# EAGLE design mcdm.v52 (EAGLE 7.3.0)

## Sheet 1 of 2
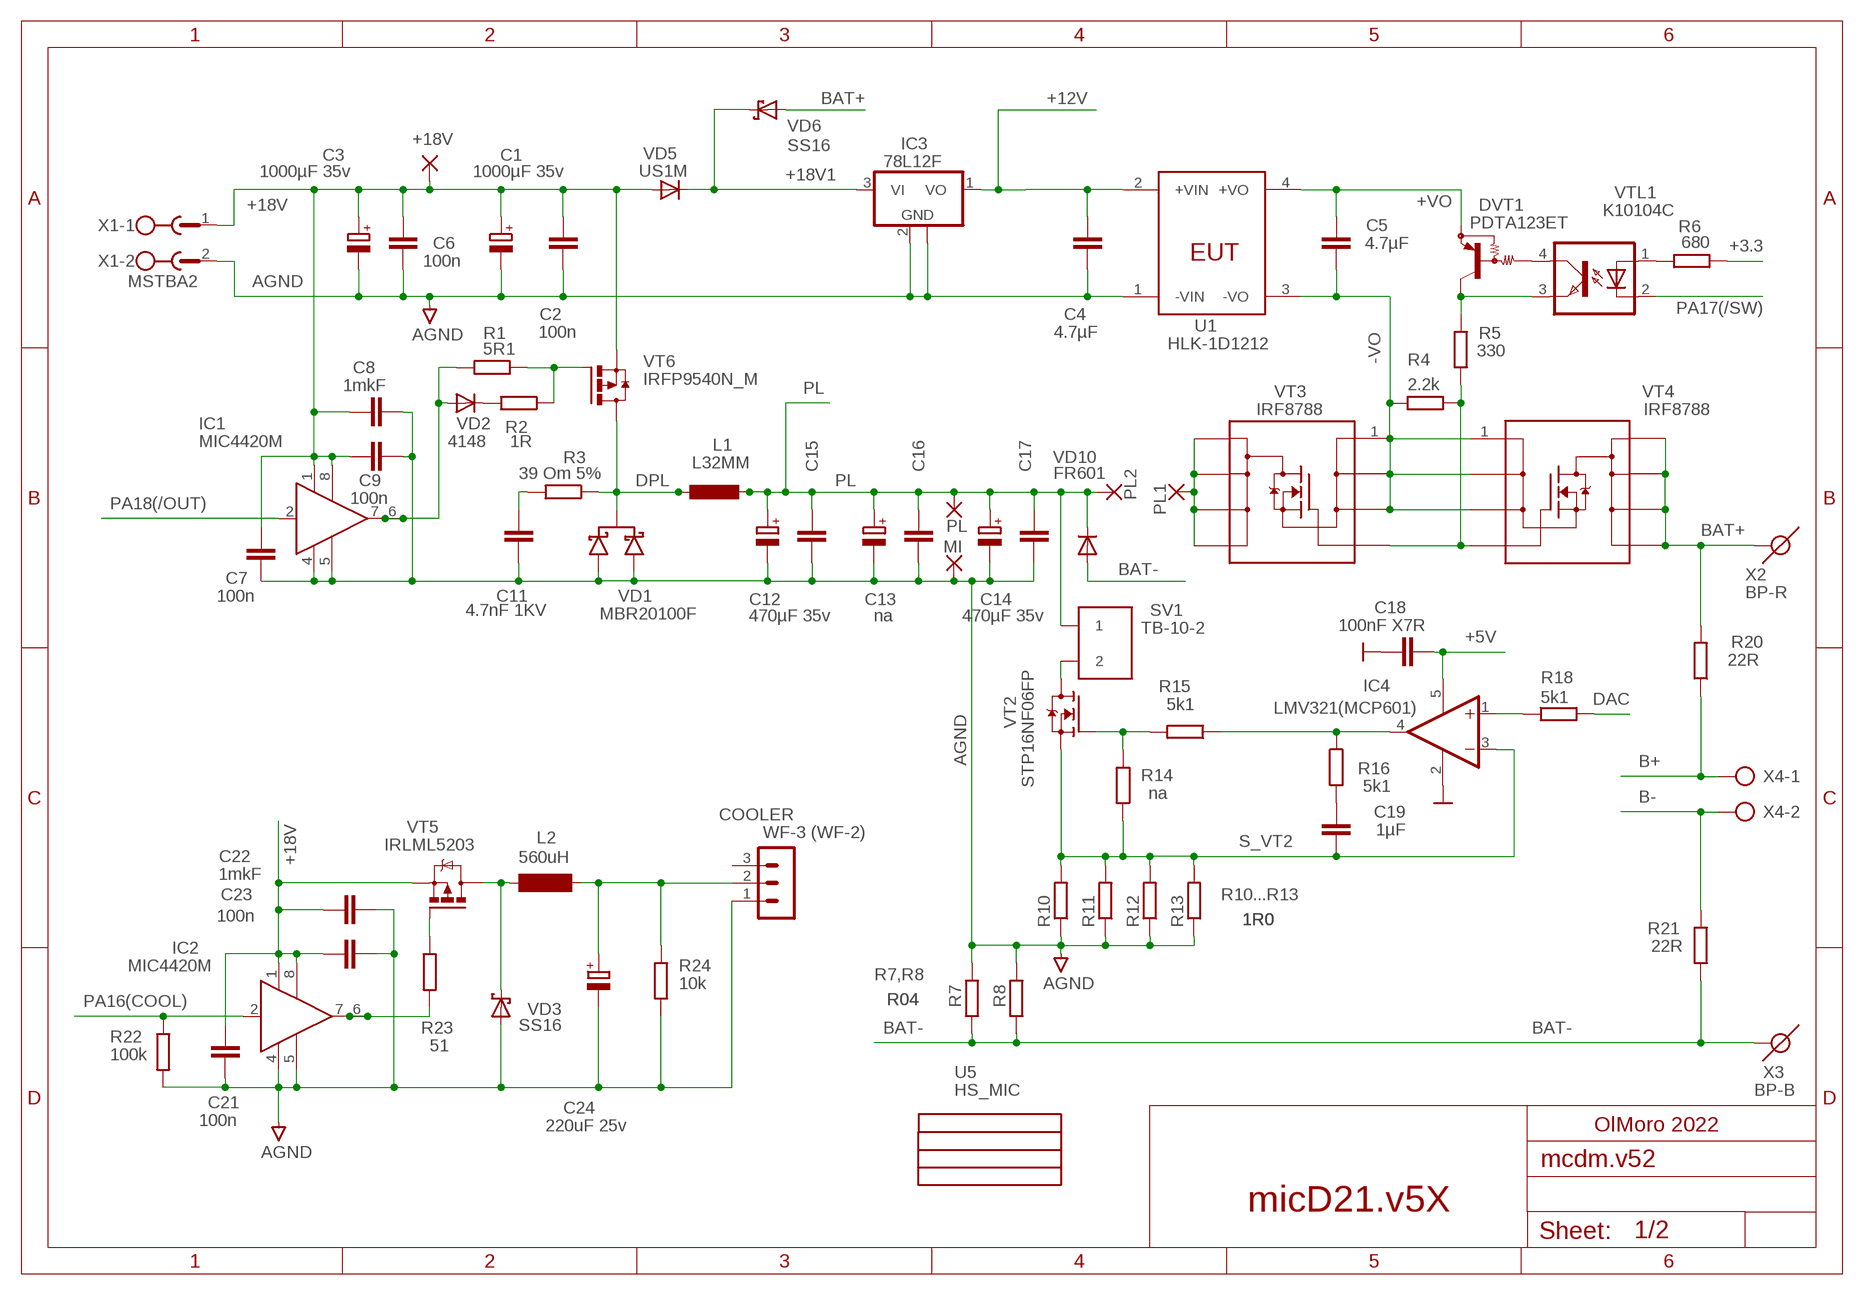
[diagram p0: schematic, sheet 1]

### Parts
+18V  WIREPAD1,6/0,8  [1,6/0,8]
C1  1000µF 35v  CPOL-EUE5-10.5  [E5-10,5]
C2  100n  C-EUC0805  [C0805]
C3  1000µF 35v  CPOL-EUE5-10.5  [E5-10,5]
C4  4.7µF  C-EUC0603  [C0603]
C5  4.7µF  C-EUC0603  [C0603]
C6  100n  C-EUC0805  [C0805]
C7  100n  C-EUC0603  [C0603]
C8  1mkF  C-EUC0603  [C0603]
C9  100n  C-EUC0603  [C0603]
C11  4.7nF 1KV  C-EU102-064X133  [C102-064X133]
C12  470µF 35v  CPOL-EUE5-10.5  [E5-10,5]
C13  na  CPOL-EUE5-10.5  [E5-10,5]
C14  470µF 35v  CPOL-EUE5-10.5  [E5-10,5]
C15  1mkF  C-EUC0805  [C0805]
C16  1mkF  C-EUC0805  [C0805]
C17  1mkF  C-EUC0805  [C0805]
C18  100nF X7R  C-EUC0603  [C0603]
C19  1µF  C-EUC0603  [C0603]
C21  100n  C-EUC0603  [C0603]
C22  1mkF  C-EUC0603  [C0603]
C23  100n  C-EUC0603  [C0603]
C24  220uF 25v  CPOL-EUE5-8.5  [E5-8,5]
COOLER  WF-3 (WF-2)  WF-3  [WF-3]
DVT1  PDTA123ET  MUN2113T1  [SC59-BEC]
IC1  MIC4420M  [SO-08]
IC2  MIC4420M  [SO-08]
IC3  78L12F  [SOT89]
IC4  LMV321(MCP601)  LM321MF  [SOT23-5]
L1  L32MM  [L22MM]
L2  560uH  BS11  [BS11]
MI  WIREPAD4,16O1,6  [4,16O1,6]
PL  WIREPAD4,16O1,6  [4,16O1,6]
PL1  WIREPAD2,54/0,8  [2,54/0,8]
PL2  WIREPAD2,54/0,8  [2,54/0,8]
R1  5R1  R-EU_R0805  [R0805]
R2  1R  R-EU_R0805  [R0805]
R3  39 Om 5%  R-0515/20  [0515/20]
R4  2.2k  R-EU_R0603  [R0603]
R5  330  R-EU_R0603  [R0603]
R6  680  R-EU_R0603  [R0603]
R7  R04  R-EU_R2512  [R2512]
R8  R04  R-EU_R2512  [R2512]
R10  1R0  R-EU_R2512  [R2512]
R11  1R0  R-EU_R2512  [R2512]
R12  1R0  R-EU_R2512  [R2512]
R13  1R0  R-EU_R2512  [R2512]
R14  na  R-EU_R0603  [R0603]
R15  5k1  R-EU_R0603  [R0603]
R16  5k1  R-EU_R0603  [R0603]
R18  5k1  R-EU_R0603  [R0603]
R20  22R  R-EU_R0603  [R0603]
R21  22R  R-EU_R0603  [R0603]
R22  100k  R-EU_R0603  [R0603]
R23  51  R-EU_R0603  [R0603]
R24  10k  R-EU_R0603  [R0603]
SV1  TB-10-2  [TB-10-2]
U1  HLK-1D1212  [HLK-1D1212]
U5  HS_MIC  [HS-MIC]
VD1  MBR20100F  [ITO220J]
VD2  4148  DIODESMA  [SMADIODE]
VD3  SS16  [DO214AC]
VD5  US1M  [DO214AC]
VD6  SS16  [DO214AC]
VD10  FR601  DIODE-1_DIODE-P6-15  [DIODE-1_P6-15]
VT2  STP16NF06FP  [TO-220FP_M]
VT3  IRF8788  [SO-8]
VT4  IRF8788  [SO-8]
VT5  IRLML5203  [MICRO3]
VT6  IRFP9540N_M  [TO-220FP_M]
VTL1  K10104C  SFH618A-3X007  [SMD4-7]
X1  MSTBA2  [MSTBA2]
X2  BP-R  [BP-R]
X3  BP-B  [BP-B]
X4  AK500/2-H  [AK500/2-H]

### Nets
+3.3: R6.1 ; also sheet 2
+5V: C18.2 IC4.5(V+) ; also sheet 2
+12V: C4.2 IC3.1(VO) U1.2(+VIN) ; also sheet 2
+18V: +18V.1(P) C1.+ C2.2 C3.+ C6.2 C7.2 C8.2 C9.2 C21.2 C22.2 C23.2 IC1.1(VS) IC1.8(VS1) IC2.1(VS) IC2.8(VS1) VD5.A VT5.2(S) VT6.3(S) X1.1 ; also sheet 2
+18V1: IC3.3(VI) VD5.C VD6.C ; also sheet 2
+VO: C5.2 DVT1.E U1.4(+VO)
-VO: C5.1 R4.2 U1.3(-VO) VT3.1(S) VT3.2(S) VT3.3(S) VT4.1(S) VT4.2(S) VT4.3(S)
AGND: C1.- C2.1 C3.- C4.1 C6.1 C7.1 C8.1 C9.1 C11.2 C12.- C13.- C14.- C15.2 C16.2 C17.2 C21.1 C22.1 C23.1 C24.- COOLER.1 IC1.4(GND) IC1.5(GND1) IC2.4(GND) IC2.5(GND1) IC3.2(GND) IC3.2@1(GND) MI.1(P) R7.2 R8.2 R10.1 R11.1 R12.1 R13.1 R22.2 R24.2 U1.1(-VIN) VD1.1(A1) VD1.3(A2) VD3.A X1.2 ; also sheet 2
B+: R20.1 X4.1 ; also sheet 2
B-: R21.1 X4.2 ; also sheet 2
BAT+: R20.2 VD6.A VT4.5(D) VT4.6(D) VT4.7(D) VT4.8(D) X2.1
BAT-: R7.1 R8.1 R21.2 VD10.A X3.1 ; also sheet 2
DAC: R18.2 ; also sheet 2
DPL: L1.2@7 L1.2@8 R3.1 VD1.2(C) VT6.2(D)
G: R4.1 R5.1 VT3.4(G) VT4.4(G)
GND: C18.1 IC4.2(V-) ; supply symbol labelled  ; also sheet 2
N$1: R6.2 VTL1.1(A)
N$2: R2.2 VD2.C
N$3: IC1.6(OUT) IC1.7(OUT) R1.2 VD2.A
N$4: R1.1 R2.1 VT6.1(G)
N$6: SV1.P$2 VT2.2(D)
N$7: C11.1 R3.2
N$9: IC2.6(OUT) IC2.7(OUT) R23.2
N$10: R23.1 VT5.1(G)
N$11: L2.1 VD3.C VT5.3(D)
N$12: C24.+ COOLER.2 L2.2 R24.1
N$35: R14.2 R15.2 VT2.1(G)
N$41: IC4.1(+IN) R18.1
N$43: C19.1 R16.2
N$53: DVT1.C R5.2 VTL1.3(EMIT)
N$54: DVT1.B VTL1.4(COL)
PA16(COOL): IC2.2(IN) R22.1 ; also sheet 2
PA17(/SW): VTL1.2(C) ; also sheet 2
PA18(/OUT): IC1.2(IN) ; also sheet 2
PL: C12.+ C13.+ C14.+ C15.1 C16.1 C17.1 L1.1 L1.1@2 PL2.1(P) PL.1(P) SV1.P$1 VD10.C
PL1: PL1.1(P) VT3.5(D) VT3.6(D) VT3.7(D) VT3.8(D)
S_VT2: C19.2 IC4.3(-IN) R10.2 R11.2 R12.2 R13.2 R14.1 VT2.3(S)
UDAC: IC4.4(OUT) R15.1 R16.1
Unconnected: COOLER.3

### Notes on the sheet
- R10...R13
- R7,R8
- OlMoro 2022
- micD21.v5X

## Sheet 2 of 2
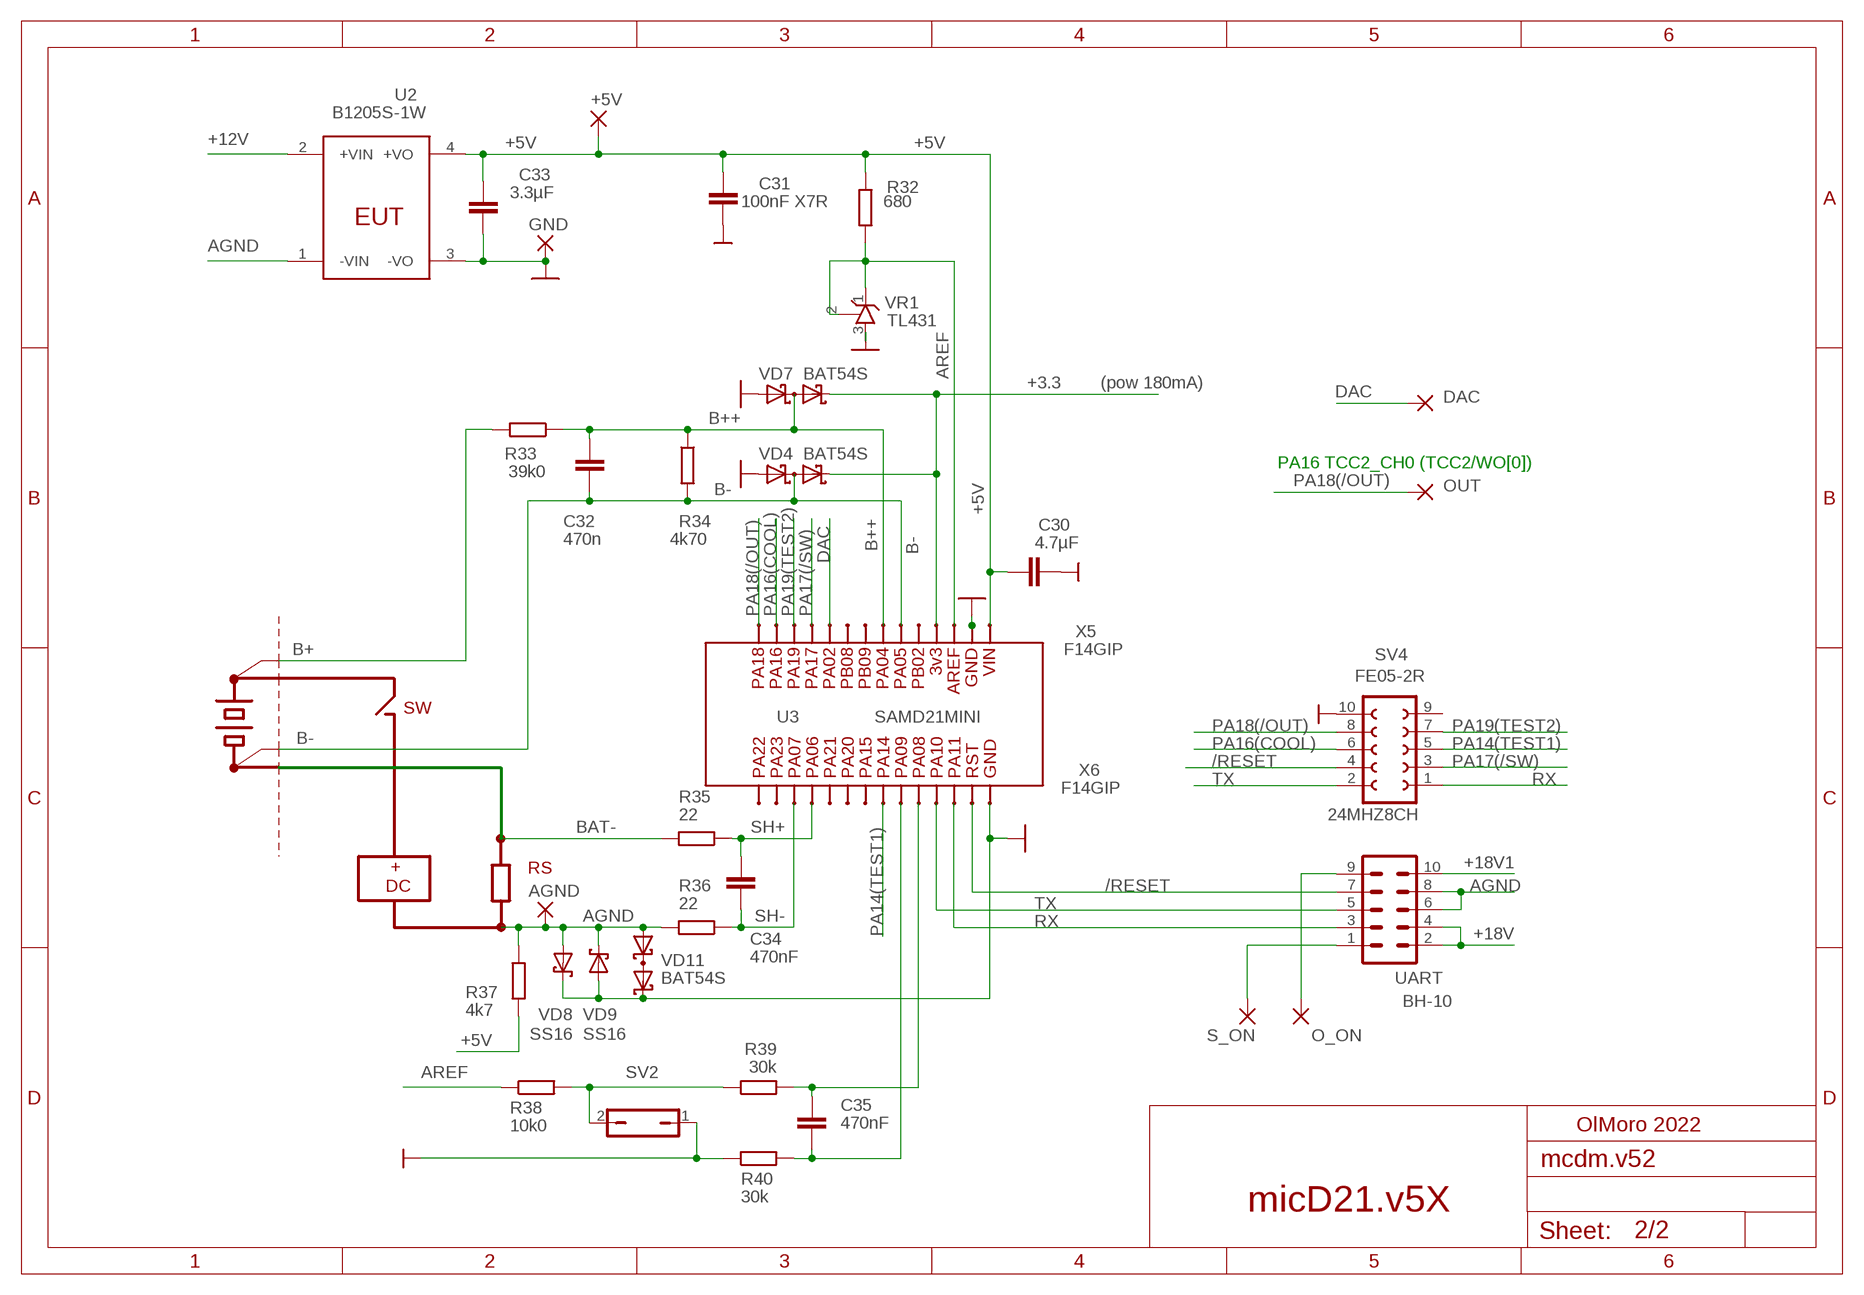
[diagram p1: schematic, sheet 2]

### Parts
24MHZ8CH  DIAGNOSTICS  [DIAGNOSTICS]
+5V  WIREPAD1,6/0,8  [1,6/0,8]
AGND  AGND  WIREPAD4,16O1,6  [4,16O1,6]
C30  4.7µF  C-EUC0805  [C0805]
C31  100nF X7R  C-EUC0603  [C0603]
C32  470n  C-EUC0603  [C0603]
C33  3.3µF  C-EUC0805  [C0805]
C34  470nF  C-EUC0603  [C0603]
C35  470nF  C-EUC0603  [C0603]
DAC  WIREPAD1,6/0,8  [1,6/0,8]
GND  GND  WIREPAD4,16O1,6  [4,16O1,6]
O_ON  WIREPAD1,6/0,8  [1,6/0,8]
OUT  WIREPAD1,6/0,8  [1,6/0,8]
R32  680  R-EU_R0603  [R0603]
R33  39k0  R-EU_R0603  [R0603]
R34  4k70  R-EU_R0603  [R0603]
R35  22  R-EU_R0603  [R0603]
R36  22  R-EU_R0603  [R0603]
R37  4k7  R-EU_R0603  [R0603]
R38  10k0  R-EU_R0603  [R0603]
R39  30k  R-EU_R0603  [R0603]
R40  30k  R-EU_R0603  [R0603]
S_ON  WIREPAD1,6/0,8  [1,6/0,8]
SV2  JP1Q  [JP1]
SV4  FE05-2R  [FE05-2R]
U2  B1205S-1W  HLK-1D1212  [HLK-1D1212]
U3  SAMD21MINI  [SAMD21MINI]
UART  BH-10  ML10  [ML10]
VD4  BAT54S  [SOT23]
VD7  BAT54S  [SOT23]
VD8  SS16  [DO214AC]
VD9  SS16  [DO214AC]
VD11  BAT54S  [SOT23]
VR1  TL431  TL431-SOT23-3  [SOT23]
X5  F14GIP  [F14GIP]
X6  F14GIP  [F14GIP]

### Nets
+3.3: VD4.2(C2) VD7.2(C2) X5.4 ; also sheet 1
+5V: +5V.1(P) C30.1 C31.1 C33.1 R32.1 R37.2 U2.4(+VO) X5.1 ; also sheet 1
+12V: U2.2(+VIN) ; also sheet 1
+18V: UART.2 UART.4 ; also sheet 1
+18V1: UART.10 ; also sheet 1
/OUT_ON: O_ON.1(P) UART.9
/RESET: SV4.4 UART.7 X6.13
/S_ON: S_ON.1(P) UART.1
AGND: AGND.1(P) R36.2 R37.1 U2.1(-VIN) UART.6 UART.8 VD8.A VD9.C VD11.1(A1) ; also sheet 1
AREF: R32.2 R38.1 VR1.1(C) VR1.2(R) X5.3
B+: R33.2 ; also sheet 1
B++: C32.1 R33.1 R34.1 VD7.3(C1A2) X5.7
B-: C32.2 R34.2 VD4.3(C1A2) X5.6 ; also sheet 1
BAT-: R35.2 ; also sheet 1
CELSIUS: C35.1 R39.2 X6.10
DAC: DAC.1(P) X5.10 ; also sheet 1
GND: C30.2 C31.2 C33.2 GND.1(P) R40.1 SV2.1 SV4.10 U2.3(-VO) VD4.1(A1) VD7.1(A1) VD8.C VD9.A VD11.2(C2) VR1.3(A) X5.2 X6.14 ; supply symbol labelled  ; also sheet 1
N$5: C35.2 R40.2 X6.9
N$13: R38.2 R39.1 SV2.2
PA14(TEST1): SV4.5 X6.8
PA16(COOL): SV4.6 X5.13 ; also sheet 1
PA17(/SW): SV4.3 X5.11 ; also sheet 1
PA18(/OUT): OUT.1(P) SV4.8 X5.14 ; also sheet 1
PA19(TEST2): SV4.7 X5.12
RX: SV4.1 UART.3 X6.12
SH+: C34.1 R35.1 X6.4
SH-: C34.2 R36.1 X6.3
TX: SV4.2 UART.5 X6.11
Unconnected: SV4.9 VD11.3(C1A2) X5.5 X5.8 X5.9 X6.1 X6.2 X6.5 X6.6 X6.7

### Notes on the sheet
- (pow 180mA)
- PA16 TCC2_CH0 (TCC2/WO[0])
- SW
- RS
- +
  DC
- OlMoro 2022
- micD21.v5X

## Library data of the parts
24MHZ8CH = Q921:DIAGNOSTICS
+5V +18V AGND DAC GND MI O_ON OUT PL PL1 PL2 S_ON = wirepad:WIREPAD: Wire PAD connect wire on PCB
C1 C3 C12-C14 C24 = rcl_moro:CPOL-EU: POLARIZED CAPACITOR, European symbol
C2 C4-C9 C11 C15-C19 C21-C23 C30-C35 = rcl_moro:C-EU: CAPACITOR, European symbol
COOLER = moro2:WF-3
DVT1 = transistor-pnp:MUN2113*: PNP Bias Resistor Transistor
IC1 IC2 = transistor-power:MIC4420: 6A-Peak Low-Side MOSFET Driver Bipolar/CMOS/DMOS Process http://www.micrel.com/_PDF/mic4420.pdf
IC3 = linear:78L*: POSITOIV-VOLTAGE REGULATORS Output up to 100 mA Source: Datasheet <http://focus.ti.com/lit/ds/symlink/ua78l05.pdf>
IC4 = linear:LM321?*: Low Power Single Op Amp Source: http://cache.national.com/ds/LM/LM321.pdf
L1 = wx-d21:L32MM
L2 = inductor-neosid-moro:BS: INDUCTOR nominal inductance, magnetically screened; OC_FARNELL: unknown; OC_NEWARK: unknown
R1 R2 R4-R8 R10-R16 R18 R20-R24 R32-R40 = rcl_moro:R-EU_: RESISTOR, European symbol
R3 = Q921:R-0515/20
SV1 = wx-d21:TB-10-2
SV2 = jumper_moro:JP1Q: JUMPER
SV4 = con-lsta_moro:FE05-2R
U1 U2 = wx-d21:HLK-1D1212
U3 = Q921:SAMD21MINI
U5 = wx-d21:HS_MIC
UART = con-harting-ml:ML10: HARTING; OC_FARNELL: unknown; OC_NEWARK: unknown
VD1 = wx-d21:MBR20100F
VD2 = microbuilder:DIODE: Diode SMADIODE - SMA Surface Mount Package 20V 1A Schottky Diode Digikey (500mV @ 1A, 500uA Vr @ 20V): 641-1014-6-ND SOD-123 30V 500mA (430mV Vf, 130uA Vr @ 30V) Schottky Diode - Digikey: B0530W-FDICT-ND SOD-323 10V 570mA (380mV Vf, 3ns) Schottky Diode - Digikey: ZLLS410CT-ND SOD-523 30V 30mA Schottky Diode (RB751S-40TE61) - Digikey: RB751S-40TE61CT-ND SOT23-R/W - SOT23 Package (R = Solder Paste/Reflow Ovens, W = Hand-Soldering) BAT54Film 40V 300mA - Digikey: 497-7162-1-ND DO-1N4148 Through Hole Small Current Diode (any model)
VD3 VD6 VD8 VD9 = diode-1:SS16
VD4 VD7 VD11 = diode:BAT54S: Schottky Diodes Pin connection corrected 2011-05-04 Source: Fairchild .. BAT54.pdf
VD5 = diode-1:US1M
VD10 = urc-2base:DIODE-1_DIODE-: DIODE
VR1 = moro4:TL431-SOT23-3
VT2 = wx-d21:STP16NF06FP
VT3 VT4 = transistor-fet_moro:IRF8788
VT5 = transistor-power:IRLML5203: HEXFET P-Channel Power MOSFET
VT6 = wx-d21:IRFP9540N_M
VTL1 = optocoupler:SFH618?*: Optocoupler, Phototransistor Output, Low Input Current Source: Data sheet <http://www.vishay.com/docs/83673/sfh618.pdf>; OC_FARNELL: unknown; OC_NEWARK: unknown
X1 = con-phoenix-508:MSTBA2: PHOENIX; MF: FARNELL; MPN: 1757242; OC_FARNELL: 3705171; OC_NEWARK: 71C4161
X2 = wx-d21:BP-R
X3 = wx-d21:BP-B
X4 = con-ptr500_moro:AK500/2-H: CONNECTOR Aug. 2004 / PTR Meßtechnik: Die Bezeichnung der Serie AK505 wurde geändert. Es handelt sich hierbei um AK500 in horizontaler Ausführung.; OC_FARNELL: unknown; OC_NEWARK: unknown
X5 X6 = wx-d21:F14GIP

## Board
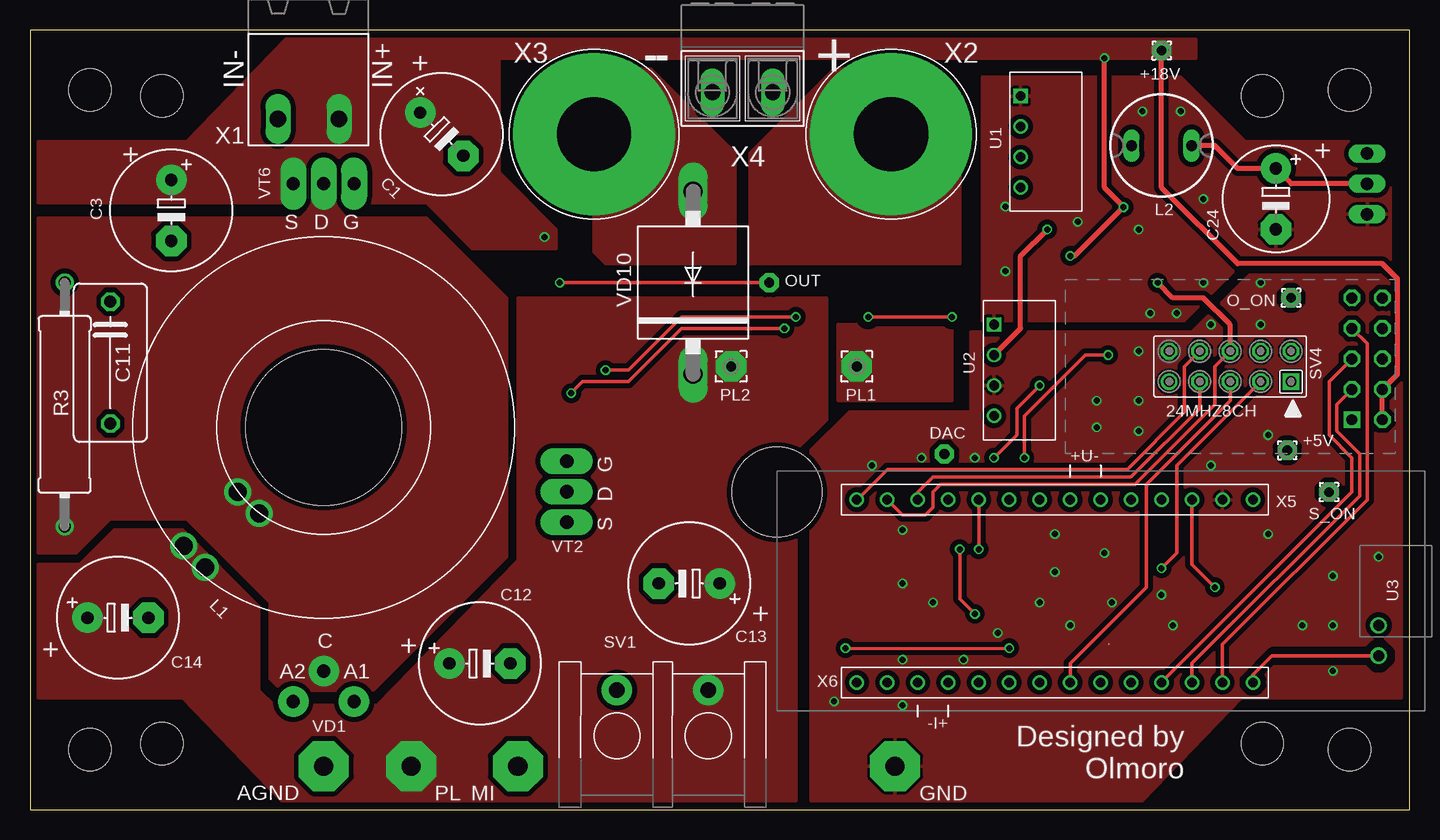
[diagram p2: board, top side]
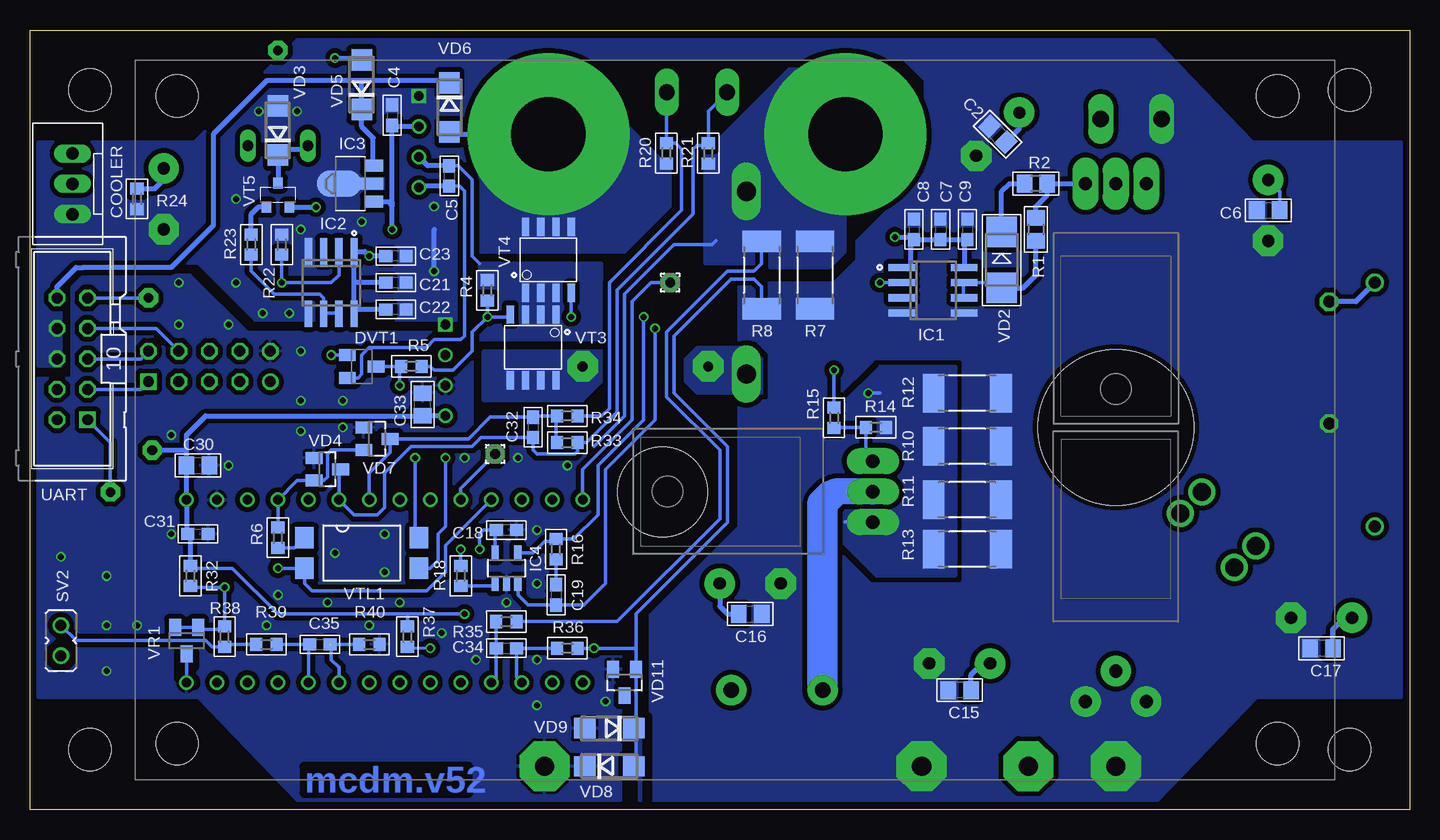
[diagram p3: board, bottom side, seen from below]

Size 115 x 65 mm. Coordinates in mm from the lower left corner, seen from the top.
Outline: 0,0 115,0 115,65 0,65 0,0
Copper layers (1*16): Top 0.018mm / dielectric 1.5mm / Bottom 0.018mm
Design rules "020204mm *": minimum track width 0.2mm, minimum drill 0.3mm, track to track 0.2mm, track to pad 0.2mm, pad to pad 0.2mm, via to via 0.2mm, smd to smd 0.2mm, copper to edge 0.4mm, drill to drill 0.4mm, minimum pad ring 0.15mm, minimum via ring 0.15mm, stop-mask expansion 4mil, vias tented up to drill 20mil, thermal gap 10mil
Holes 3.5 mm at 5,5 5,60 110,60 110,5 11,59.5 102.73,59.5 102.73,5.5 11,5.5
Holes 7.5 mm at 62.26,26.47
Holes 13 mm at 24.48,31.86
tRestrict: 17 lines
bRestrict: 19 lines
vRestrict: area 2,2 to 8,8; area 8,2.5 to 14,8.5; area 2,57 to 8,63; area 8,56.5 to 14,62.5; area 99.8,56.5 to 105.8,62.5; area 107,57 to 113,63; area 107,2 to 113,8; area 99.8,2.5 to 105.8,8.5

### Footprints (pad centres in the part's own frame; a part is rotated, then mirrored left to right if it is on the bottom)
1,6/0,8 = drill 0.813 pad 1.6 octagon: 1 0,0
4,16O1,6 = drill 1.6 pad 4.166 octagon: 1 0,0
E5-10,5 = drill 1.016 pad 2.54: + -2.54,0 | drill 1.016 pad 2.54 octagon: - 2.54,0
C0805 = smd 1.3 x 1.5: 1 -0.95,0; 2 0.95,0
C0603 = smd 1.1 x 1: 1 -0.85,0; 2 0.85,0
C102-064X133 = drill 1.016 octagon: 1 -5.08,0; 2 5.08,0
E5-8,5 = drill 1.016 pad 2.54: + -2.54,0 | drill 1.016 pad 2.54 octagon: - 2.54,0
WF-3 = drill 1.016 long: 1 0,-2.54; 2 0,0; 3 0,2.54
SC59-BEC = smd 1 x 1.4: B -0.95,-1.2; C 0,1.2; E 0.95,-1.2
SO-08 = smd 0.6 x 2.2: 1 -1.905,-2.6; 2 -0.635,-2.6; 3 0.635,-2.6; 4 1.905,-2.6; 5 1.905,2.6; 6 0.635,2.6; 7 -0.635,2.6; 8 -1.905,2.6
SOT89 = smd 1 x 1.5: 1 -1.499,-1.981; 3 1.499,-1.981 | smd 1 x 2: 2 0,-1.727 | smd 2.2 x 3.7: 2@1 0,0.94
SOT23-5 = smd 0.6 x 1.2: 1 -0.95,-1.306; 2 0,-1.306; 3 0.95,-1.306; 4 0.95,1.306; 5 -0.95,1.306
L22MM = drill 1.5: 1 -1.27,15.24; 1@2 1.27,15.24; 2@7 -1.27,8.89; 2@8 1.27,8.89
BS11 = drill 0.9 long: 1 -2.5,0; 2 2.5,0
2,54/0,8 = drill 0.813 pad 2.54 octagon: 1 0,0
R0805 = smd 1.3 x 1.5: 1 -0.95,0; 2 0.95,0
0515/20 = drill 1.016: 1 -10.16,0; 2 10.16,0
R0603 = smd 1 x 1.1: 1 -0.85,0; 2 0.85,0
R2512 = smd 1.8 x 3.2: 1 -2.8,0; 2 2.8,0
TB-10-2 = drill 1.3 pad 2.54: P$1 -3.81,0; P$2 3.81,0
JP1 = drill 0.914: 1 0,-1.27; 2 0,1.27
FE05-2R = drill 0.914 square: 1 5.08,-1.27 | drill 0.914 octagon: 2 5.08,1.27; 3 2.54,-1.27; 4 2.54,1.27; 5 0,-1.27; 6 0,1.27; 7 -2.54,-1.27; 8 -2.54,1.27; 10 -5.08,1.27 | drill 0.914: 9 -5.08,-1.27
HLK-1D1212 = drill 0.8 square: 1 -3.81,0 | drill 0.8: 2 -1.27,0; 3 1.27,0; 4 3.81,0
ML10 = drill 0.914 square: 1 -5.08,-1.27 | drill 0.914 octagon: 2 -5.08,1.27; 3 -2.54,-1.27; 4 -2.54,1.27; 5 0,-1.27; 6 0,1.27; 7 2.54,-1.27; 8 2.54,1.27; 9 5.08,-1.27; 10 5.08,1.27
ITO220J = drill 1.118 pad 2.54: 1 2.54,-2.54; 2 0,0; 3 -2.54,-2.54
SMADIODE = smd 2.54 x 2.54: A 2.349,0; C -2.349,0
DO214AC = smd 1.8 x 1.7: A 2.05,0; C -2.05,0
SOT23 = smd 1 x 1.4: 1 -0.95,-1.1; 2 0.95,-1.1; 3 0,1.1
DIODE-1_P6-15 = drill 1.6 long: A 7.62,0; C -7.62,0
TO-220FP_M = drill 1.118 pad 2.184 long: 1 2.54,0; 2 0,0; 3 -2.54,0
SO-8 = smd 1.524 x 0.61: 1 -2.743,1.905; 2 -2.743,0.635; 3 -2.743,-0.635; 4 -2.743,-1.905; 5 2.743,-1.905; 6 2.743,-0.635; 7 2.743,0.635; 8 2.743,1.905
MICRO3 = smd 0.8 x 0.9: 1 -0.95,-1; 2 0.95,-1; 3 0,1
SMD4-7 = smd 1.78 x 1.55: 1 -1.27,-4.77; 2 1.27,-4.77; 3 1.27,4.77; 4 -1.27,4.77
MSTBA2 = drill 1.397 long: 1 -2.54,5.08; 2 2.54,5.08
BP-R = drill 6.2 pad 13.5: 1 0,0
BP-B = drill 6.2 pad 13.5: 1 0,0
AK500/2-H = drill 1.321 long: 1 -2.515,0; 2 2.515,0
F14GIP = drill 0.8: 1 -16.51,0; 2 -13.97,0; 3 -11.43,0; 4 -8.89,0; 5 -6.35,0; 6 -3.81,0; 7 -1.27,0; 8 1.27,0; 9 3.81,0; 10 6.35,0; 11 8.89,0; 12 11.43,0; 13 13.97,0; 14 16.51,0

### Placement (x,y rotation side)
24MHZ8CH  100.05,36.95 0 top
+5V  104.81,29.96 180 top
+18V  94.33,63.3 90 top
AGND  24.48,3.61 0 top
C1  34.32,56.31 315 top
C2  34.32,56.31 315 bottom
C3  11.78,49.96 270 top
C4  84.81,57.9 270 bottom
C5  80.04,52.82 270 bottom
C6  11.78,49.96 0 bottom
C7  39.09,48.38 270 bottom
C8  41.31,48.38 270 bottom
C9  36.86,48.38 270 bottom
C11  6.7,37.26 270 top
C12  37.5,12.18 0 top
C13  54.96,18.85 180 top
C14  7.34,15.99 0 top
C15  37.5,9.96 180 bottom
C16  54.96,16.31 0 bottom
C17  7.34,13.45 180 bottom
C18  75.28,23.29 180 bottom
C19  71.15,17.89 270 bottom
C21  84.49,43.93 180 bottom
C22  84.49,41.71 180 bottom
C23  84.49,46.15 180 bottom
C24  103.85,50.91 270 top
C30  101,28.69 0 bottom
C31  101,22.98 0 bottom
C32  73.06,31.86 270 bottom
C33  82.27,33.77 90 bottom
C34  75.28,13.45 0 bottom
C35  90.84,13.77 0 bottom
COOLER  111.46,52.17 0 bottom
DAC  76.23,29.64 90 bottom
DVT1  87.34,36.95 270 bottom
GND  72.11,3.61 0 top
IC1  39.72,43.3 270 bottom
IC2  89.88,43.93 180 bottom
IC3  88.3,52.19 90 bottom
IC4  75.28,20.12 0 bottom
L1  24.48,31.86 135 top
L2  94.33,55.36 0 top
MI  40.67,3.61 0 top
O_ON  105.12,42.66 0 top
OUT  61.63,43.93 270 bottom
PL  31.78,3.61 0 top
PL1  68.93,36.95 0 top
PL2  58.45,36.95 0 top
R1  31.15,48.38 270 bottom
R2  31.15,52.19 180 bottom
R3  2.89,33.77 90 top
R4  76.87,43.3 90 bottom
R5  83.22,36.95 180 bottom
R6  94.33,22.66 270 bottom
R7  49.56,44.56 270 bottom
R8  54.01,44.56 270 bottom
R10  36.86,30.28 180 bottom
R11  36.86,25.83 180 bottom
R12  36.86,34.72 180 bottom
R13  36.86,21.7 180 bottom
R14  44.48,31.86 180 bottom
R15  47.98,32.66 270 bottom
R16  71.15,21.7 270 bottom
R18  79.09,19.48 90 bottom
R20  61.95,54.73 270 bottom
R21  58.45,54.73 270 bottom
R22  94.01,47.11 90 bottom
R23  96.55,47.11 270 bottom
R24  106.08,50.91 270 bottom
R32  101.63,19.48 270 bottom
R33  70.2,32.82 0 bottom
R34  70.2,30.59 0 bottom
R35  75.28,15.67 0 bottom
R36  70.2,13.45 0 bottom
R37  83.53,14.4 90 bottom
R38  98.78,14.4 270 bottom
R39  95.28,13.77 0 bottom
R40  86.71,13.77 180 bottom
S_ON  108.3,26.47 0 top
SV1  52.74,9.96 180 top
SV2  112.43,14.09 0 bottom
SV4  100.05,36.95 0 top
U1  82.58,55.68 270 top
U2  80.36,36.63 270 top
U3  89.25,18.21 0 top
U5  56.23,32.5 0 top
UART  111.47,37.58 90 bottom
VD1  24.48,11.55 0 top
VD2  34,45.84 270 bottom
VD3  94.33,56.63 90 bottom
VD4  90.2,28.37 270 bottom
VD5  87.34,60.44 90 bottom
VD6  80.04,58.53 270 bottom
VD7  86.08,30.91 270 bottom
VD8  66.71,3.61 0 bottom
VD9  66.71,6.78 180 bottom
VD10  55.28,43.93 90 top
VD11  65.44,10.59 180 bottom
VR1  101.95,14.09 180 bottom
VT2  44.74,26.51 90 bottom
VT3  73.06,38.53 270 bottom
VT4  71.79,45.84 90 bottom
VT5  94.33,51.23 0 bottom
VT6  24.48,52.19 180 bottom
VTL1  87.34,21.39 270 bottom
X1  23.21,62.66 180 top
X2  71.79,56.31 0 top
X3  47.02,56.31 0 top
X4  59.41,59.8 180 top
X5  85.44,25.83 180 top
X6  85.44,10.59 0 top

### Tracks (layer width: path | path; a pad name or v marks a point on that pad's centre or on a via)
+3.3
  Bottom 0.305: R6.1 X5.4 92.74,27.42 VD4.2 90.52,27.42 90.2,27.74 90.2,29.64 89.88,29.96 VD7.2
+5V  (via drill 0.5)
  Top 0.305: v78.77,16.31 77.5,17.58 v77.5,21.7
  Bottom 0.305: 101.63,20.12 98.14,20.12 94.33,16.31 83.53,16.31 | 83.53,16.31 R37.2 | 83.53,16.31 v78.77,16.31 | v77.5,21.7 77.5,22.98 77.19,23.29 C18.2 76.23,23.19 IC4.5
  Bottom 0.406: 101.63,20.12 R32.1 101.63,22.98 C31.1 101.95,23.08 X5.1 C30.1 101.95,29.96 | 101.95,29.96 101.95,31.23 100.36,32.82 C33.1 U2.4 | +5V.1 101.95,29.96
+12V  (via drill 0.5)
  Top 0.406: v84.81,48.38 82.58,46.15 82.58,40.12 U2.2
  Bottom 0.406: U1.2 84.7,56.95 C4.2 84.81,50.6 84.89,50.69 85.12,50.69 | IC3.1 85.12,50.69 | v84.81,48.38 84.81,50.37 85.12,50.69
+18V  (via drill 0.5)
  Top 0.406: UART.2 UART.4 114.02,36.31 114.02,44.25 112.75,45.52 100.68,45.52 94.33,51.87 +18V.1 | v89.57,62.66 89.57,51.87 91.16,50.28 v91.16,50.23 87.08,46.15 v86.71,46.15
  Bottom 0.305: C6.2 10.83,51.55 C3.+
  Bottom 0.406: 36.55,45.2 IC1.8 37.12,47.52 C9.2 C7.2 C8.2 | 87.98,43.93 IC2.8 87.98,41.71 C22.2 | 87.98,43.93 IC2.1 87.09,46.53 v86.71,46.15 C23.2 | C21.2 87.98,43.93 | VT5.2 v91.16,50.23 | v42.89,47.74 41.31,47.74 C8.2 | C8.2 41.62,47.52 41.62,45.2 IC1.1 | C2.2 32.53,56.77 C1.+ | v89.57,62.66 87.52,62.66 VD5.A
  pour Top (isolate 0.406, no thermals): 21.3,64.25 13.05,55.68 0.67,55.68 0.67,50.6 22.26,50.6 22.26,53.77 27.34,53.77 27.34,50.6 33.05,50.6 36.86,46.79 43.85,46.79 43.85,48.38 39.09,53.14 39.09,62.66 97.19,62.66 97.19,64.25
+18V1
  Bottom 0.406: 87.34,60.76 80.22,60.76 VD6.C | 87.34,60.76 95.28,60.76 99.73,56.31 99.73,48.69 103.22,45.2 110.52,45.2 111.16,45.2 112.75,43.61 112.75,42.98 UART.10 | 87.34,60.76 VD5.C 87.34,56.95 86.39,56 86.39,53.77 86.32,53.7 IC3.3
+VO
  Bottom 0.305: C5.2 79.19,51.97 78.77,51.55 78.77,39.48 79.09,39.17 81.31,39.17 81.95,38.53 86.71,38.53 87.34,37.9 87.34,36.31 87.66,35.99 DVT1.E
  Bottom 0.406: C5.2 82.48,51.97 U1.4
-VO
  Bottom 0.305: 77.5,45.52 78.14,46.15 78.14,52.5 79.31,53.67 C5.1
  Bottom 0.406: C5.1 81.84,53.67 U1.3
  pour Bottom (isolate 0.406, no thermals): 67.34,45.52 77.5,45.52 77.5,39.17 67.34,39.17
/OUT_ON
  Bottom 0.305: O_ON.1 UART.9
/RESET
  Top 0.305: X6.13 99.41,13.77 111.47,25.83 111.47,38.85 UART.7
  Bottom 0.305: UART.7 104.49,40.12 SV4.4
/S_ON
  Bottom 0.305: S_ON.1 108.3,30.59 UART.1
AGND  (via drill 0.5)
  Top 0.254: v67.98,13.45 v81.63,13.45
  Bottom 0.254: v81.63,13.45 83.53,13.45 R37.1
  Bottom 0.305: R8.2 54.01,43.61 54.64,44.25 56.55,44.25 61.31,39.48 61.31,34.72 56.87,30.28 56.87,23.93 64.48,16.31 64.48,13.45 | R36.2 v67.98,13.45 64.48,13.45 | VD11.1 64.48,6.95 VD9.C 64.48,6.78 64.48,3.78 VD8.A | 64.48,13.45 VD11.1 | VD11.1
  Bottom 0.406: v81.31,44.88 81.31,48.38
  other vias: 81.31,50.28 87.34,49.01 92.42,48.38 93.38,41.39 95.6,41.39 97.82,43.93 97.82,50.91 95.92,58.22 92.74,58.22
  pour Top (isolate 0.406): 79.41,40.76 79.41,61.08 95.92,61.08 101.31,55.68 112.43,55.68 113.38,54.73 113.38,45.52 101,45.52 96.23,40.76
  pour Bottom (isolate 0.406, rank 2, no thermals): 55.91,23.61 55.91,43.61 54.96,43.61 54.64,43.3 54.64,42.02 53.37,42.02 53.37,43.93 47.98,43.93 46.07,45.84 46.07,47.42 40.36,53.14 40.36,60.76 42.26,62.66 74.64,62.66 78.45,58.85 78.45,40.76 96.23,40.76 101,45.52 111.16,45.52 112.43,44.25 112.43,36.95 114.33,36.95 114.33,55.68 101.31,55.68 92.74,64.25 21.28,64.25 13.05,55.68 0.67,55.68 0.67,9.32 12.73,9.32 20.99,0.75 64.17,0.75 64.17,15.36
AREF  (via drill 0.5)
  Top 0.305: X5.3 96.87,20.44 v98.78,18.53
  Bottom 0.305: VR1.2 VR1.1 100.85,15.04 98.78,15.04 R38.1 v98.78,18.53 101.53,18.53 R32.2
B+
  Bottom 0.305: X4.1 61.95,59.78 R20.1 61.21,55.58 60.67,55.04 60.67,49.96 66.71,43.93 66.71,33.45 67.34,32.82 R33.2
B++
  Bottom 0.305: R34.1 71.15,30.7 71.15,32.82 R33.1 72.95,32.82 C32.1 76.65,32.72 78.45,30.91 VD7.3 84.97,29.79 86.71,28.05 X5.7
B-
  Bottom 0.305: X4.2 58.45,58.24 R21.1 58.45,55.36 59.41,55.36 59.72,55.04 59.72,49.64 66.07,43.3 66.07,33.13 68.61,30.59 R34.2 69.35,29.86 69.56,29.64 72.74,29.64 73.06,29.96 C32.2 77.4,31.02 78.14,30.28 83.22,30.28 85.44,28.05 85.44,25.2 86.08,24.56 87.98,24.56 X5.6 89.25,28.23 VD4.3
BAT+
  Bottom 0.406: VD6.A 79.87,56.31 X2.1
  pour Top (isolate 0.406, no thermals): 60.04,45.52 77.5,45.52 77.5,58.22 74.01,61.71 67.03,61.71 60.04,54.73
  pour Bottom (isolate 0.406, no thermals): 65.44,46.47 77.5,46.47 77.5,58.22 74.01,61.71 69.88,61.71 61.63,53.45 61.63,50.28
BAT-
  Bottom 0.305: R35.2 66.07,15.67 57.5,24.24 57.5,29.96 61.95,34.41 61.95,39.8 56.87,44.88 54.64,44.88 54.01,45.52 R8.1 | 67.98,30.28 65.44,32.82 65.44,42.98 61.31,47.11 58.13,47.11 57.82,47.42
  pour Top (isolate 0.61, no thermals): 51.78,61.71 48.29,61.71 47.02,60.44 47.02,46.47 47.98,45.52 58.77,45.52 58.77,54.73
  pour Bottom (isolate 0.406, no thermals): 47.02,46.47 47.02,60.44 48.29,61.71 51.78,61.71 58.77,54.73 58.77,45.52 54.64,45.52 54.64,47.11 53.37,47.11 53.37,45.2 48.29,45.2
CELSIUS
  Bottom 0.305: X6.10 91.79,13.77 C35.1 R39.2
DAC  (via drill 0.5)
  Top 0.305: v79.09,21.7 X5.10
  Bottom 0.305: X5.10 79.09,26.79 DAC.1 | R18.2 v79.09,21.7
DPL
  pour Top (isolate 0.406, no thermals): 0.67,49.33 22.62,49.33 22.62,49.37 23.21,49.96 23.25,52.82 25.75,52.82 25.75,49.96 26.39,49.33 33.05,49.33 39.72,42.66 39.72,21.07 28.61,9.96 20.99,9.96 20.03,10.91 20.03,17.26 13.05,24.24 6.7,24.24 3.84,21.39 0.67,21.39
G  (via drill 0.5)
  Top 0.305: v69.88,41.07 v76.87,41.07
  Bottom 0.305: VT4.4 v69.88,41.07 | v76.87,41.07 74.96,41.07 VT3.4 | R5.1 81.63,36.95 81.31,36.63 79.72,36.63 78.14,38.22 78.14,39.8 v76.87,41.07 | v76.87,41.07 R4.1
GND  (via drill 0.5)
  Top 0.305: X6.14 101.95,11.23 103.54,12.82 SV2.1
  Bottom 0.305: X6.14 VR1.3
  other vias: 108.62,19.48 102.59,40.44 98.46,28.69 94.33,17.89 86.71,15.36 95.28,15.36 106.08,15.36 108.62,15.36 85.44,19.8 102.59,43.93 77.82,12.5 72.74,18.85 72.74,8.69 75.28,17.26 72.74,23.29 92.42,34.09 88.93,31.86 78.77,29.32 92.42,38.22 85.44,22.98 67.03,9 108.62,11.55 103.22,31.23 72.74,12.5 80.68,14.72 103.22,22.98 112.43,21.07 74.33,29.32 70.2,28.69 89.57,21.39 98.46,40.44 88.93,34.09 92.42,31.55 84.17,17.26 90.2,17.26
  pour Bottom (isolate 0.406, rank 2): 114.33,9.32 114.33,35.99 111.47,35.99 111.47,43.61 110.52,44.56 101.63,44.56 96.87,39.8 78.14,39.8 78.14,30.28 65.75,30.28 65.75,0.75 92.74,0.75 101,9.32
  pour Top (isolate 0.406, rank 2): 114.33,9.32 114.33,44.56 101.63,44.56 96.87,39.8 78.45,39.8 78.45,33.13 68.3,33.13 65.12,29.96 65.12,0.75 92.74,0.75 101,9.32
N$1
  Bottom 0.305: VTL1.1 92.97,21.81 R6.2
N$2
  Bottom 0.406: VD2.C 34,51.55 33.37,52.19 R2.2
N$3
  Bottom 0.305: IC1.6 37.18,42.72 37.18,43.93 IC1.7 34.45,43.93 VD2.A
  Bottom 0.406: VD2.A 32.23,43.49 31.15,44.56 R1.2
N$4
  Bottom 0.406: R1.1 31.15,50.28 30.2,51.23 R2.1 VT6.1
N$5  (1 unrouted)
  Bottom 0.305: X6.9 89.25,11.86 89.88,12.5 89.88,13.77 | R40.2 C35.2
N$6
  Bottom 2.184: VT2.2 47.94,26.51 48.29,26.15
  Bottom 2.54: SV1.P$2 48.93,25.52 48.29,26.15
N$7
  Bottom 0.406: R3.2 4.48,42.34 C11.1
N$9
  Bottom 0.305: R23.2 96.55,44.88 94.65,42.98 90.84,42.98 90.52,42.66 IC2.6 90.46,41.39 89.25,41.39 IC2.7
N$10
  Bottom 0.406: R23.1 96.55,49.64 95.97,50.23 VT5.1
N$11
  Bottom 0.406: L2.1 92.15,55.04 94.33,55.04 VD3.C VT5.3
N$12
  Top 0.406: L2.2 98.78,55.36 100.68,53.45 C24.+ 105.14,52.17 COOLER.2
  Bottom 0.406: R24.1 104.59,51.77 103.85,52.5 C24.+
N$13
  Bottom 0.305: R39.1 98.56,13.77 R38.2 99.83,13.55 100.36,14.09 111.16,14.09 SV2.2
N$35
  Bottom 0.305: VT2.1 45.33,29.64 R14.2 47.92,31.86 R15.2
N$41
  Bottom 0.305: IC4.1 76.41,18.63 R18.1
N$43
  Bottom 0.305: R16.2 C19.1
N$53  (via drill 0.5)
  Top 0.305: v84.17,35.36 82.27,33.45 82.27,31.23 v80.36,29.32
  Bottom 0.305: v80.36,29.32 80.36,23.61 81,22.98 81,20.75 81.63,20.12 VTL1.3 | DVT1.C R5.2 84.17,36.84 v84.17,35.36
N$54  (via drill 0.5)
  Top 0.305: v82.9,29.32 82.9,32.82 87.98,37.9 v89.88,37.9
  Bottom 0.305: v82.9,29.32 82.9,22.98 VTL1.4 | v89.88,37.9 DVT1.B
PA14(TEST1)
  Top 0.305: SV4.5 100.05,34.09 93.06,27.1 93.06,18.53 86.71,12.18 X6.8
PA16(COOL)  (via drill 0.5)
  Top 0.305: X5.13 72.74,24.56 74.64,24.56 75.28,25.2 75.28,26.47 75.91,27.1 92.11,27.1 98.78,33.77 98.78,36.95 SV4.6
  Top 0.406: SV4.6 100.05,40.44 97.82,42.66 95.28,42.66 v94.01,43.93
  Bottom 0.305: R22.1 v94.01,43.93 89.88,43.93 89.25,44.56 IC2.2
PA17(/SW)  (via drill 0.5)
  Top 0.305: SV4.3 95.6,28.69 95.6,21.39 v94.33,20.12
  Bottom 0.305: X5.11 80.36,22.02 80.36,19.8 81.95,18.21 91.47,18.21 92.12,18.86 VTL1.2 v94.33,20.12
PA18(/OUT)  (via drill 0.5)
  Top 0.305: SV4.8 96.23,36.95 96.23,33.13 91.47,28.37 71.47,28.37 X5.14 | v44.16,43.93 OUT.1
  Bottom 0.305: OUT.1 63.22,43.93 64.8,42.34 64.8,32.5 68.93,28.37 X5.14 | v44.16,43.93 IC1.2
PA19(TEST2)
  Top 0.305: X5.12 74.01,26.47 75.28,27.74 91.79,27.74 97.5,33.45 SV4.7
PL
  Bottom 0.406: C15.1 36.55,11.23 35.59,12.18 C12.+ | C17.1 6.38,15.04 5.43,15.99 C14.+ | C13.+ 57.5,16.94 56.87,16.31 C16.1
  pour Top (isolate 0.406, no thermals): 0.67,9.32 0.67,20.44 4.16,20.44 7.02,23.29 12.73,23.29 19.08,16.94 19.08,9.96 20.35,8.69 28.93,8.69 40.67,20.75 40.67,42.66 66.39,42.66 66.39,32.5 63.85,29.96 63.85,0.75 20.99,0.75 12.73,9.32
  pour Bottom (isolate 0.61, no thermals): 59.41,34.72 60.36,35.67 60.36,37.58 59.41,38.53 54.96,38.53 54.01,37.58 54.01,34.72
PL1
  pour Top (isolate 0.61, no thermals): 67.34,40.44 76.87,40.44 76.87,34.09 67.34,34.09
  pour Bottom (isolate 0.406, no thermals): 67.34,38.22 77.19,38.22 77.19,34.09 68.93,34.09 67.34,35.67
RX
  Top 0.305: X6.12 96.87,12.18 110.84,26.15 110.84,29.64 108.94,31.55 108.94,33.77 UART.3
  Bottom 0.305: SV4.1 105.76,35.04 UART.3
S_VT2  (via drill 0.5)
  Top 0.305: v62.9,40.12 54.33,40.12 49.88,35.67 46.07,35.67 v45.12,34.72
  Bottom 0.305: IC4.3 74.33,17.9 73.48,17.05 C19.2 68.83,17.05 67.03,18.85 67.03,28.37 62.9,32.5 v62.9,40.12 | v45.12,34.72 44.16,34.72 | VT2.3 47.06,23.97
  pour Bottom (isolate 0.406, no thermals): 44.48,19.48 37.81,19.48 37.81,36.95 44.16,36.95 47.34,33.77 47.34,22.34
SH+
  Bottom 0.305: R35.1 C34.1 76.13,11.01 X6.4
SH-
  Bottom 0.305: X6.3 74.43,11.01 C34.2 R36.1
TX
  Top 0.305: X6.11 110.2,26.47 110.2,29.32 108.3,31.23 108.3,35.67 UART.5
  Bottom 0.305: SV4.2 105.76,37.58 UART.5
UDAC  (via drill 0.5)
  Top 0.305: v63.85,41.07 54.33,41.07 49.88,36.63 v47.98,36.63
  Bottom 0.305: R15.1 v47.98,36.63 | v63.85,41.07 63.85,32.5 67.66,28.69 67.66,24.56 69.67,22.55 R16.1 71.15,22.34 72.11,22.34 73.06,21.39 74.29,21.39 IC4.4 74.33,21.07

### Text on the board
Bottom: mcdm.v52
tPlace: + | + | + | +U- | + | + | + | -I+ | Designed by / Olmoro
tNames: + | - | - | IN- | IN+